# Altium project RGB_led_controller_v1.0.PrjPcb
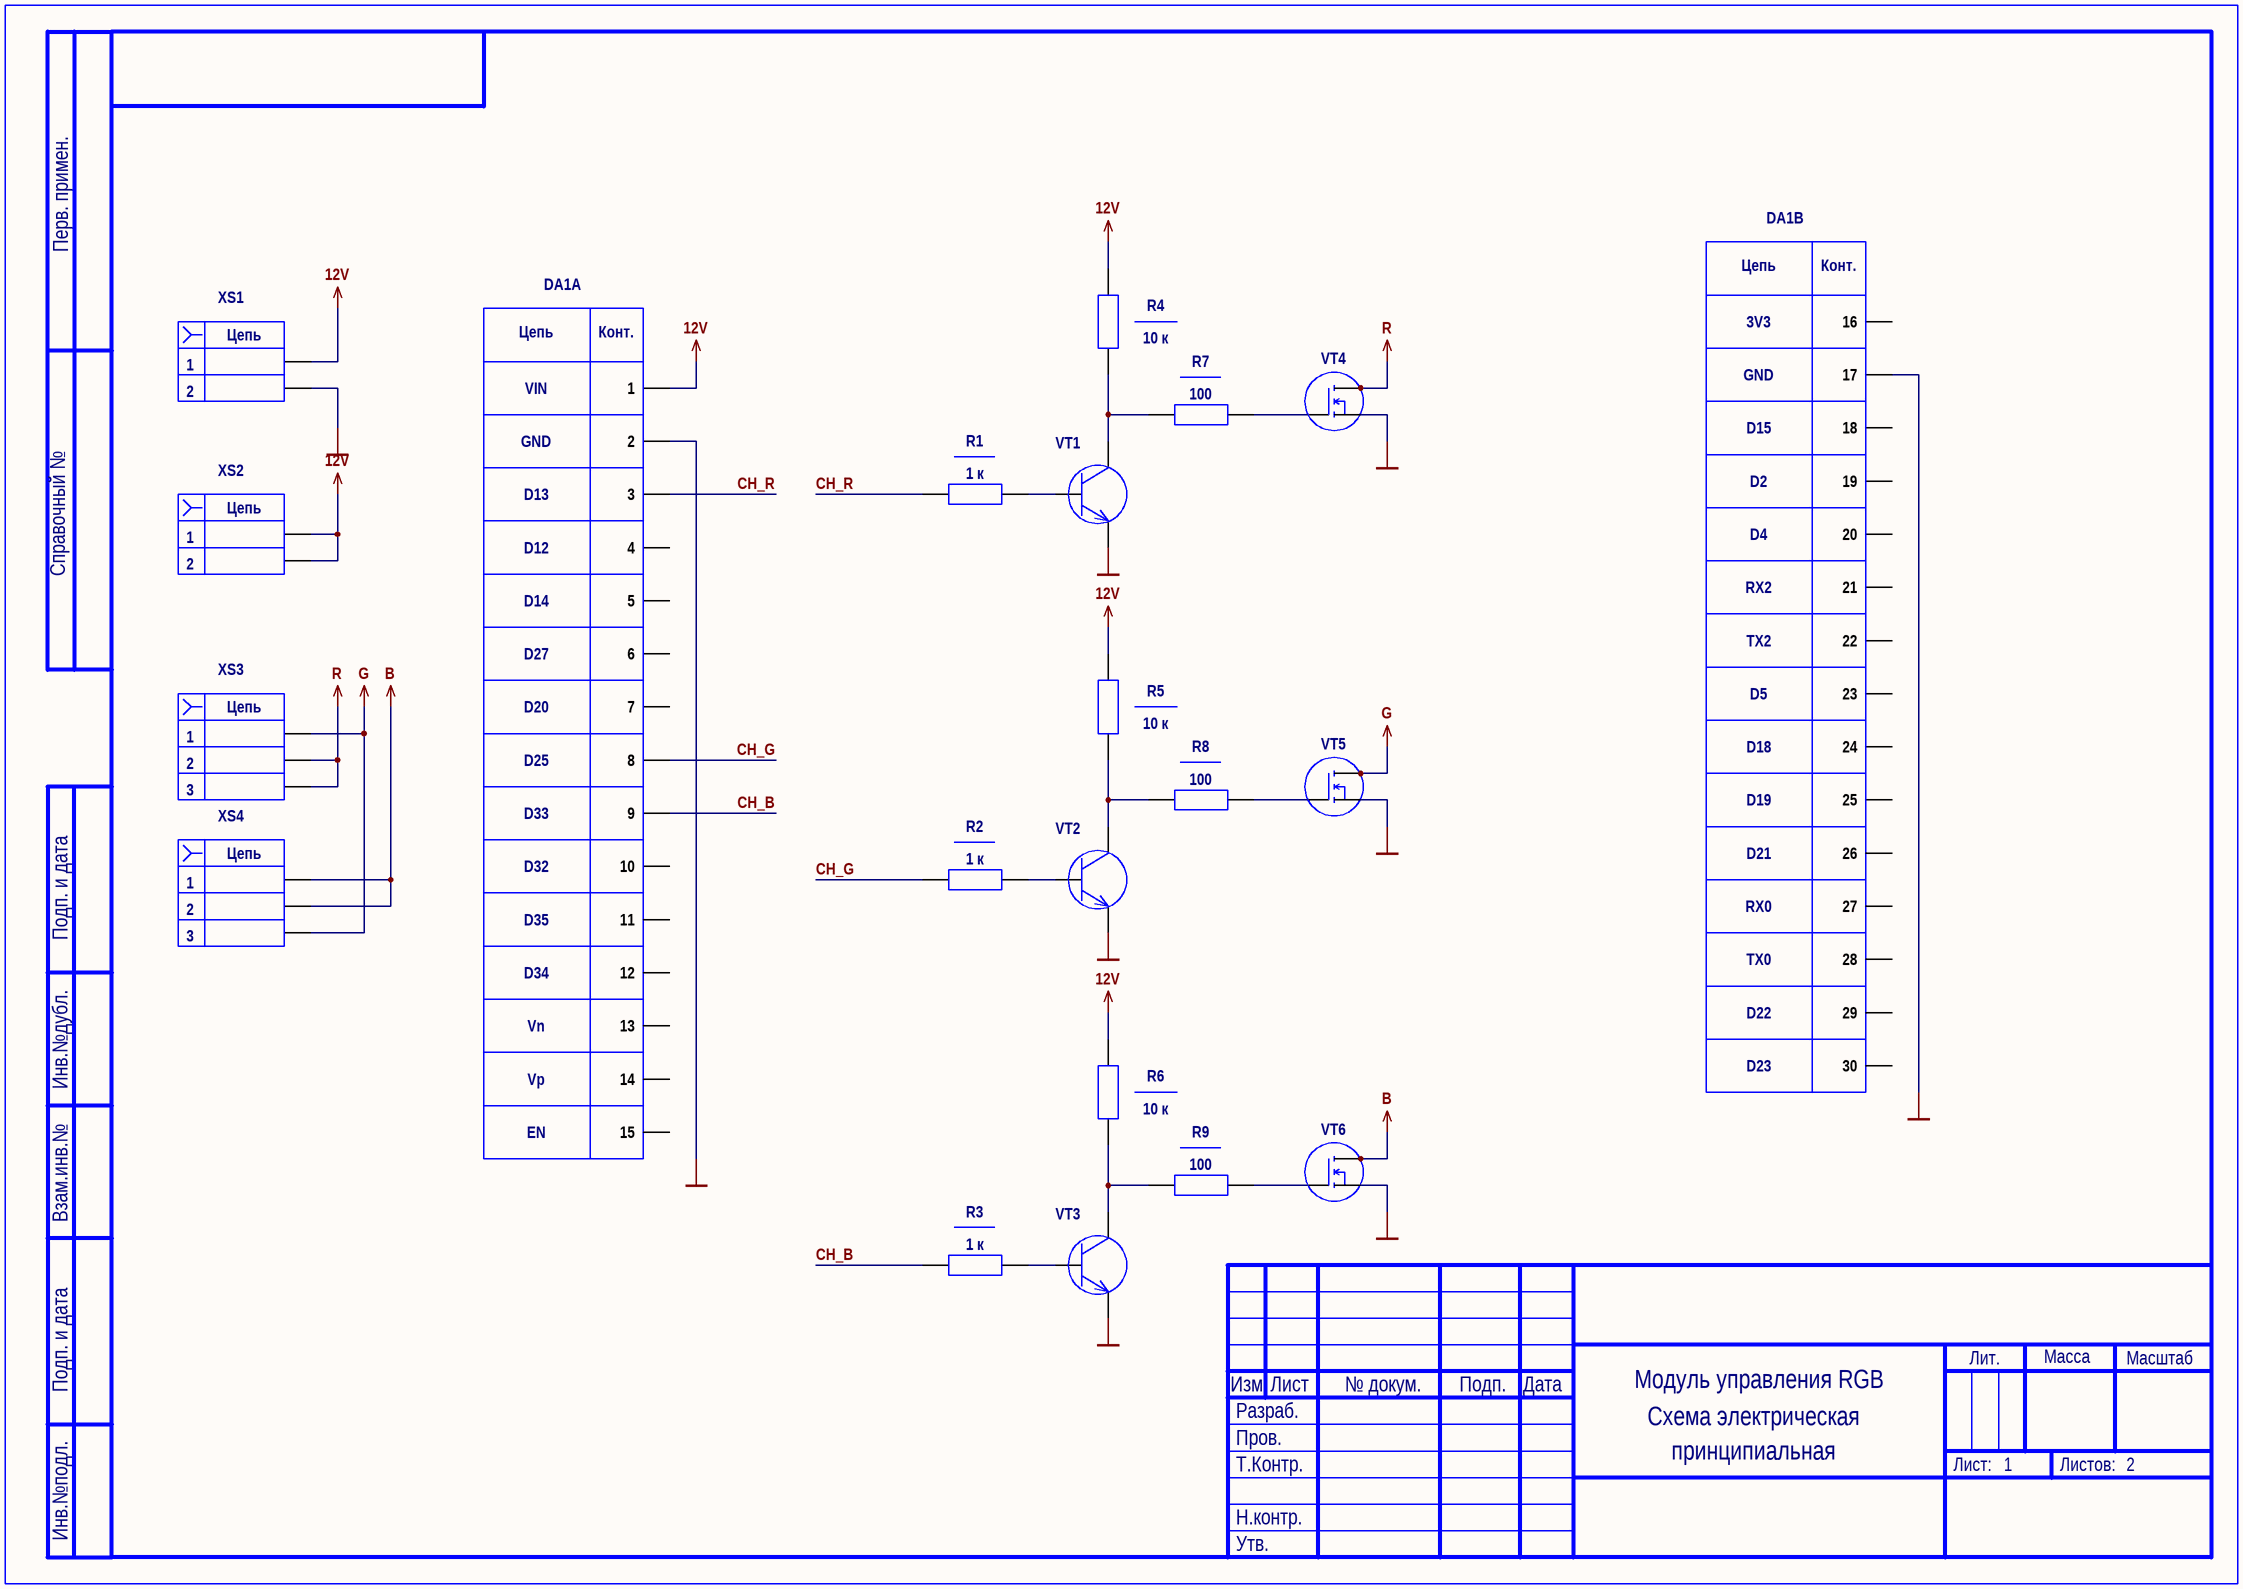
[diagram p0: RGB_01.SchDoc]
2 sheets, 20 parts. Net scope: global (net labels, ports and power ports of the same name join across sheets).
Board file: RGB_led_controller_v1.0.PcbDoc
Sheets:
  RGB_01.SchDoc
  RGB_02.SchDoc

## Sheet RGB_01.SchDoc
size 420 x 297 mm; DocumentNumber: 1; SheetNumber: 1; SheetTotal: 2; Modul: Модуль управления RGB; Tip_schema1: Схема электрическая; Tip_schema2: принципиальная; List: 1; Listov: 2

### Parts
DA1  ESP32-WROOM-DEVKIT-30pinArduino  [ESP32-WROOM-DEVKIT-30pin]  (value not drawn)  (parts A,B of 2)
R1  Сопротивление (для схемы): 1 к  [Chip_Resistor_0805]  (hidden comment: 0805 1 кОм 5%)
R2  Сопротивление (для схемы): 1 к  [Chip_Resistor_0805]  (hidden comment: 0805 1 кОм 5%)
R3  Сопротивление (для схемы): 1 к  [Chip_Resistor_0805]  (hidden comment: 0805 1 кОм 5%)
R4  Сопротивление (для схемы): 10 к  [Chip_Resistor_0805]  (hidden comment: 0805 10 кОм 5%)
R5  Сопротивление (для схемы): 10 к  [Chip_Resistor_0805]  (hidden comment: 0805 10 кОм 5%)
R6  Сопротивление (для схемы): 10 к  [Chip_Resistor_0805]  (hidden comment: 0805 10 кОм 5%)
R7  Сопротивление (для схемы): 100  [Chip_Resistor_0805]  (hidden comment: 0805 100 Ом 5%)
R8  Сопротивление (для схемы): 100  [Chip_Resistor_0805]  (hidden comment: 0805 100 Ом 5%)
R9  Сопротивление (для схемы): 100  [Chip_Resistor_0805]  (hidden comment: 0805 100 Ом 5%)
VT1  2Т3130А9/ПК  [2Т3130_(КТ-46)]  (value not drawn)
VT2  2Т3130А9/ПК  [2Т3130_(КТ-46)]  (value not drawn)
VT3  2Т3130А9/ПК  [2Т3130_(КТ-46)]  (value not drawn)
VT4  IRF8707  [IRF8707_SO8]  (value not drawn)
VT5  IRF8707  [IRF8707_SO8]  (value not drawn)
VT6  IRF8707  [IRF8707_SO8]  (value not drawn)
XS1  KLS2-128-7.50-02P-4S  [KLS2-128-7.50-02P-4S]  (value not drawn)
XS2  KLS2-128-7.50-02P-4S  [KLS2-128-7.50-02P-4S]  (value not drawn)
XS3  KLS2-128I-5.00-03P-4S  [KLS2-128I-5.00-03P-4S]  (value not drawn)
XS4  KLS2-128I-5.00-03P-4S  [KLS2-128I-5.00-03P-4S]  (value not drawn)

### Nets
12V: DA1.1 R4.1 R5.1 R6.1 XS1.1 XS2.1 XS2.2
B: VT6.5(С) VT6.6(С) VT6.7(С) VT6.8(С) XS4.1 XS4.2
G: VT5.5(С) VT5.6(С) VT5.7(С) VT5.8(С) XS3.1 XS4.3
GND: DA1.2 DA1.17 VT1.2(E) VT2.2(E) VT3.2(E) VT4.1(И) VT4.2(И) VT4.3(И) VT5.1(И) VT5.2(И) VT5.3(И) VT6.1(И) VT6.2(И) VT6.3(И) XS1.2
R: VT4.5(С) VT4.6(С) VT4.7(С) VT4.8(С) XS3.2 XS3.3
CH_B: DA1.9 R3.1
CH_G: DA1.8 R2.1
CH_R: DA1.3 R1.1
NetR1_2: R1.2 VT1.1(B)
NetR2_2: R2.2 VT2.1(B)
NetR3_2: R3.2 VT3.1(B)
NetR4_2: R4.2 R7.1 VT1.3(C)
NetR5_2: R5.2 R8.1 VT2.3(C)
NetR6_2: R6.2 R9.1 VT3.3(C)
NetR7_2: R7.2 VT4.4(З)
NetR8_2: R8.2 VT5.4(З)
NetR9_2: R9.2 VT6.4(З)

Not connected (* = marked no-connect by the designer): DA1 4 5 6 7 10 11 12 13 14 15 16 18 19 20 21 22 23 24 25 26 27 28 29 30

### Notes on the sheet
- Перв. примен.
- Справочный №
- Подп. и дата
- Инв.№дубл.
- Взам.инв.№
- Изм.
- Разраб.
- Лист
- № докум.
- Подп.
- Дата
- Лит.
- Масса
- Масштаб
- Т.Контр.
- Пров.
- Лист:
- Листов:
- Инв.№подл.
- Утв.
- Н.контр.
- (in symbol ESP32-WROOM-DEVKIT-30pin, part A) Цепь; Конт.; VIN; GND; D13; D12; D14; D27; D20; D25; D33; D32; D35; D34; Vn; Vp; EN
- (in symbol ESP32-WROOM-DEVKIT-30pin, part B) Цепь; Конт.; 3V3; GND; D15; D2; D4; RX2; TX2; D5; D18; D19; D21; RX0; TX0; D22; D23
- (in symbol KLS2-128-7.50-02P-4S) Цепь
- (in symbol KLS2-128I-5.00-03P-4S) Цепь

### Library data of the parts
DA1 = ESP32-WROOM-DEVKIT-30pin
R1-R3 = 51: Резистор 0805; Part Number: ERJ-6GEYJ102V; Для списка Part Number: Резистор ERJ-6GEYJ102V; Тип резистора: 0805; Сопротивление: 1 кОм; Мanufacturer: Panasonic; Страна: Япония; Мощность (Вт): 0,125; Ом: 1000; Tmin: -55; Tmax: 155; Отечественный аналог: Р1-8В-0,125-1 кОм±5%-М-А-М; Для списка номинал: Резистор 0805 1 кОм 5%; Autor: Смирнов К.О.; Design Item ID: 51; Отклонение: 5%; СП ПЭ: ERJ-6GEYJ102V; Date: 02.09.2014
R4-R6 = 75: Резистор 0805; Part Number: ERJ-6GEYJ103V; Для списка Part Number: Резистор ERJ-6GEYJ103V; Тип резистора: 0805; Сопротивление: 10 кОм; Мanufacturer: Panasonic; Страна: Япония; Мощность (Вт): 0,125; Ом: 10000; Tmin: -55; Tmax: 155; Отечественный аналог: Р1-8В-0,125-10 кОм±5%-М-А-М; Для списка номинал: Резистор 0805 10 кОм 5%; Autor: Смирнов К.О.; Design Item ID: 75; Отклонение: 5%; СП ПЭ: ERJ-6GEYJ103V; Date: 02.09.2014
R7-R9 = 27: Резистор 0805; Part Number: ERJ-6GEYJ101V; Для списка Part Number: Резистор ERJ-6GEYJ101V; Тип резистора: 0805; Сопротивление: 100 Ом; Мanufacturer: Panasonic; Страна: Япония; Мощность (Вт): 0,125; Tmin: -55; Tmax: 155; Отечественный аналог: Р1-8В-0,125-100 Ом±5%-Т-А-М; Для списка номинал: Резистор 0805 100 Ом 5%; Autor: Смирнов К.О.; Design Item ID: 27; Отклонение: 5%; Ом: 100; СП ПЭ: ERJ-6GEYJ101V; Date: 02.09.2014
VT1-VT3 = 6: Кремниевый эпитаксиально-планарный n-p-n транзистор; Manufacturer: ООО "АРСЕНАЛ "КРЗПП"; Для списка Part Number: Транзистор 2Т3130А9/ПК АЕЯР.432140.259ТУ; ТУ: АЕЯР.432140.259ТУ; Tmin: -60; Tmax: 85; Страна: Россия; Autor: Смирнов; Design Item ID: 6; Part Number: 2Т3130А9/ПК; Категория: Транзистор; Date: 14.10.2014

## Sheet RGB_02.SchDoc
size 420 x 297 mm; DocumentNumber: 2; SheetNumber: 2; SheetTotal: 2; List: 2
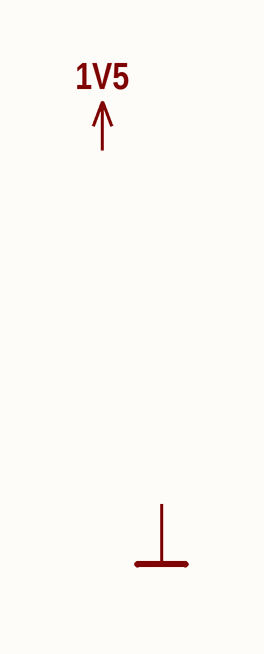
[diagram p1: RGB_02.SchDoc]

### Notes on the sheet
- Labels drawn without touching a wire or pin: 1V5, GND
- Подп. и дата
- Инв.№дубл.
- Взам.инв.№
- Инв.№подл.
- Изм.
- Лист
- № докум.
- Подп.
- Дата